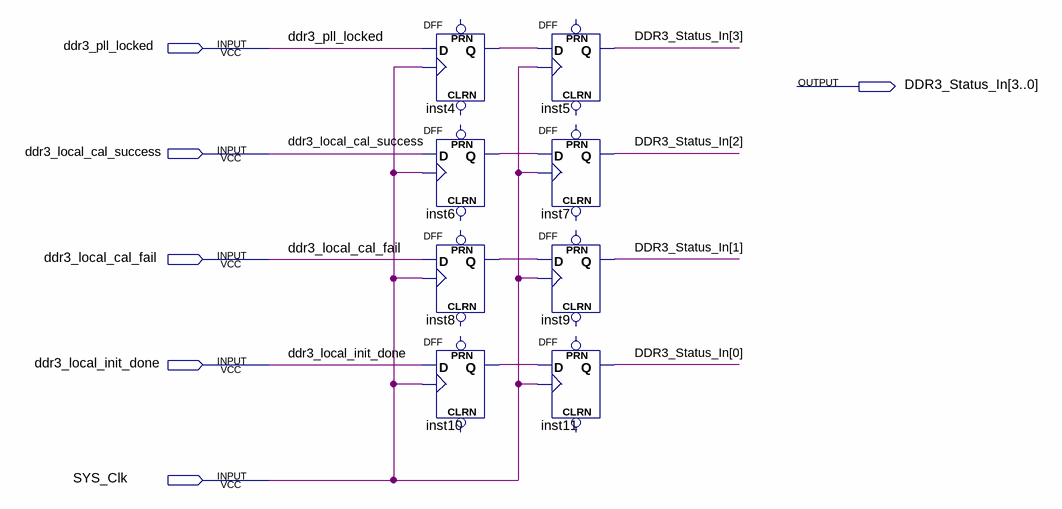
[diagram p0: schematic sheet]
// Quartus schematic DDR3_Status_Buffer.bdf as structural Verilog: 8 symbols, 6 pins
module DDR3_Status_Buffer (
  input  ddr3_pll_locked,
  input  ddr3_local_cal_success,
  input  ddr3_local_cal_fail,
  input  ddr3_local_init_done,
  input  SYS_Clk,
  output [3:0] DDR3_Status_In
);

  wire inst4_q, inst6_q, inst8_q, inst10_q;

  DFF inst4 (.CLK(SYS_Clk), .D(ddr3_pll_locked), .Q(inst4_q));  // open: CLRN, PRN
  DFF inst6 (.CLK(SYS_Clk), .D(ddr3_local_cal_success), .Q(inst6_q));  // open: CLRN, PRN
  DFF inst8 (.CLK(SYS_Clk), .D(ddr3_local_cal_fail), .Q(inst8_q));  // open: CLRN, PRN
  DFF inst10 (.CLK(SYS_Clk), .D(ddr3_local_init_done), .Q(inst10_q));  // open: CLRN, PRN
  DFF inst5 (.CLK(SYS_Clk), .D(inst4_q), .Q(DDR3_Status_In[3]));  // open: CLRN, PRN
  DFF inst7 (.CLK(SYS_Clk), .D(inst6_q), .Q(DDR3_Status_In[2]));  // open: CLRN, PRN
  DFF inst9 (.CLK(SYS_Clk), .D(inst8_q), .Q(DDR3_Status_In[1]));  // open: CLRN, PRN
  DFF inst11 (.CLK(SYS_Clk), .D(inst10_q), .Q(DDR3_Status_In[0]));  // open: CLRN, PRN
endmodule
